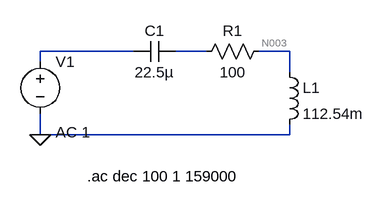
[diagram p0: schematic pasaalto.asc]
pasaalto.asc, the LTspice schematic file:
Version 4.1
SHEET 1 880 680
WIRE 96 96 -48 96
WIRE 208 96 160 96
WIRE 336 96 288 96
WIRE -48 112 -48 96
WIRE 336 128 336 96
WIRE -48 224 -48 192
WIRE 336 224 336 208
WIRE 336 224 -48 224
FLAG -48 224 0
SYMBOL res 304 80 R90
WINDOW 0 0 56 VBottom 2
WINDOW 3 32 56 VTop 2
SYMATTR InstName R1
SYMATTR Value 100
SYMBOL cap 160 80 R90
WINDOW 0 0 32 VBottom 2
WINDOW 3 32 32 VTop 2
SYMATTR InstName C1
SYMATTR Value 22.5µ
SYMBOL voltage -48 96 R0
WINDOW 123 24 124 Left 2
WINDOW 39 0 0 Left 0
SYMATTR Value2 AC 1
SYMATTR InstName V1
SYMATTR Value ""
SYMBOL ind 320 112 R0
SYMATTR InstName L1
SYMATTR Value 112.54m
TEXT 24 288 Left 2 !.ac dec 100 1 159000

The netlist it stands for:
* pasaalto.asc
R1 N003 N002 100
C1 N002 N001 22.5µ
V1 N001 0 AC 1
L1 N003 0 112.54m
.ac dec 100 1 159000
.backanno
.end

* Results of the author's LTspice run, read from the files saved beside the schematic
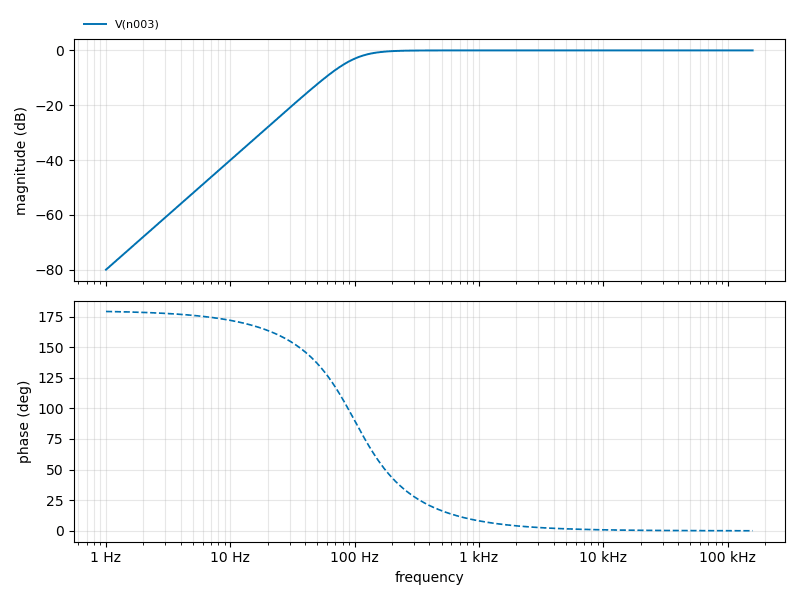
[diagram p1: AC Analysis of pasaalto.asc, plotted from the saved traces]
* AC Analysis, 1 run:
*   V(n003): -80.00 dB at 1 Hz, 0.00 dB at 159 kHz, peak 0.00 dB at 5.495 kHz, 3 dB below the peak at 100 Hz